# EAGLE design atx4vc (EAGLE 9.6.2)
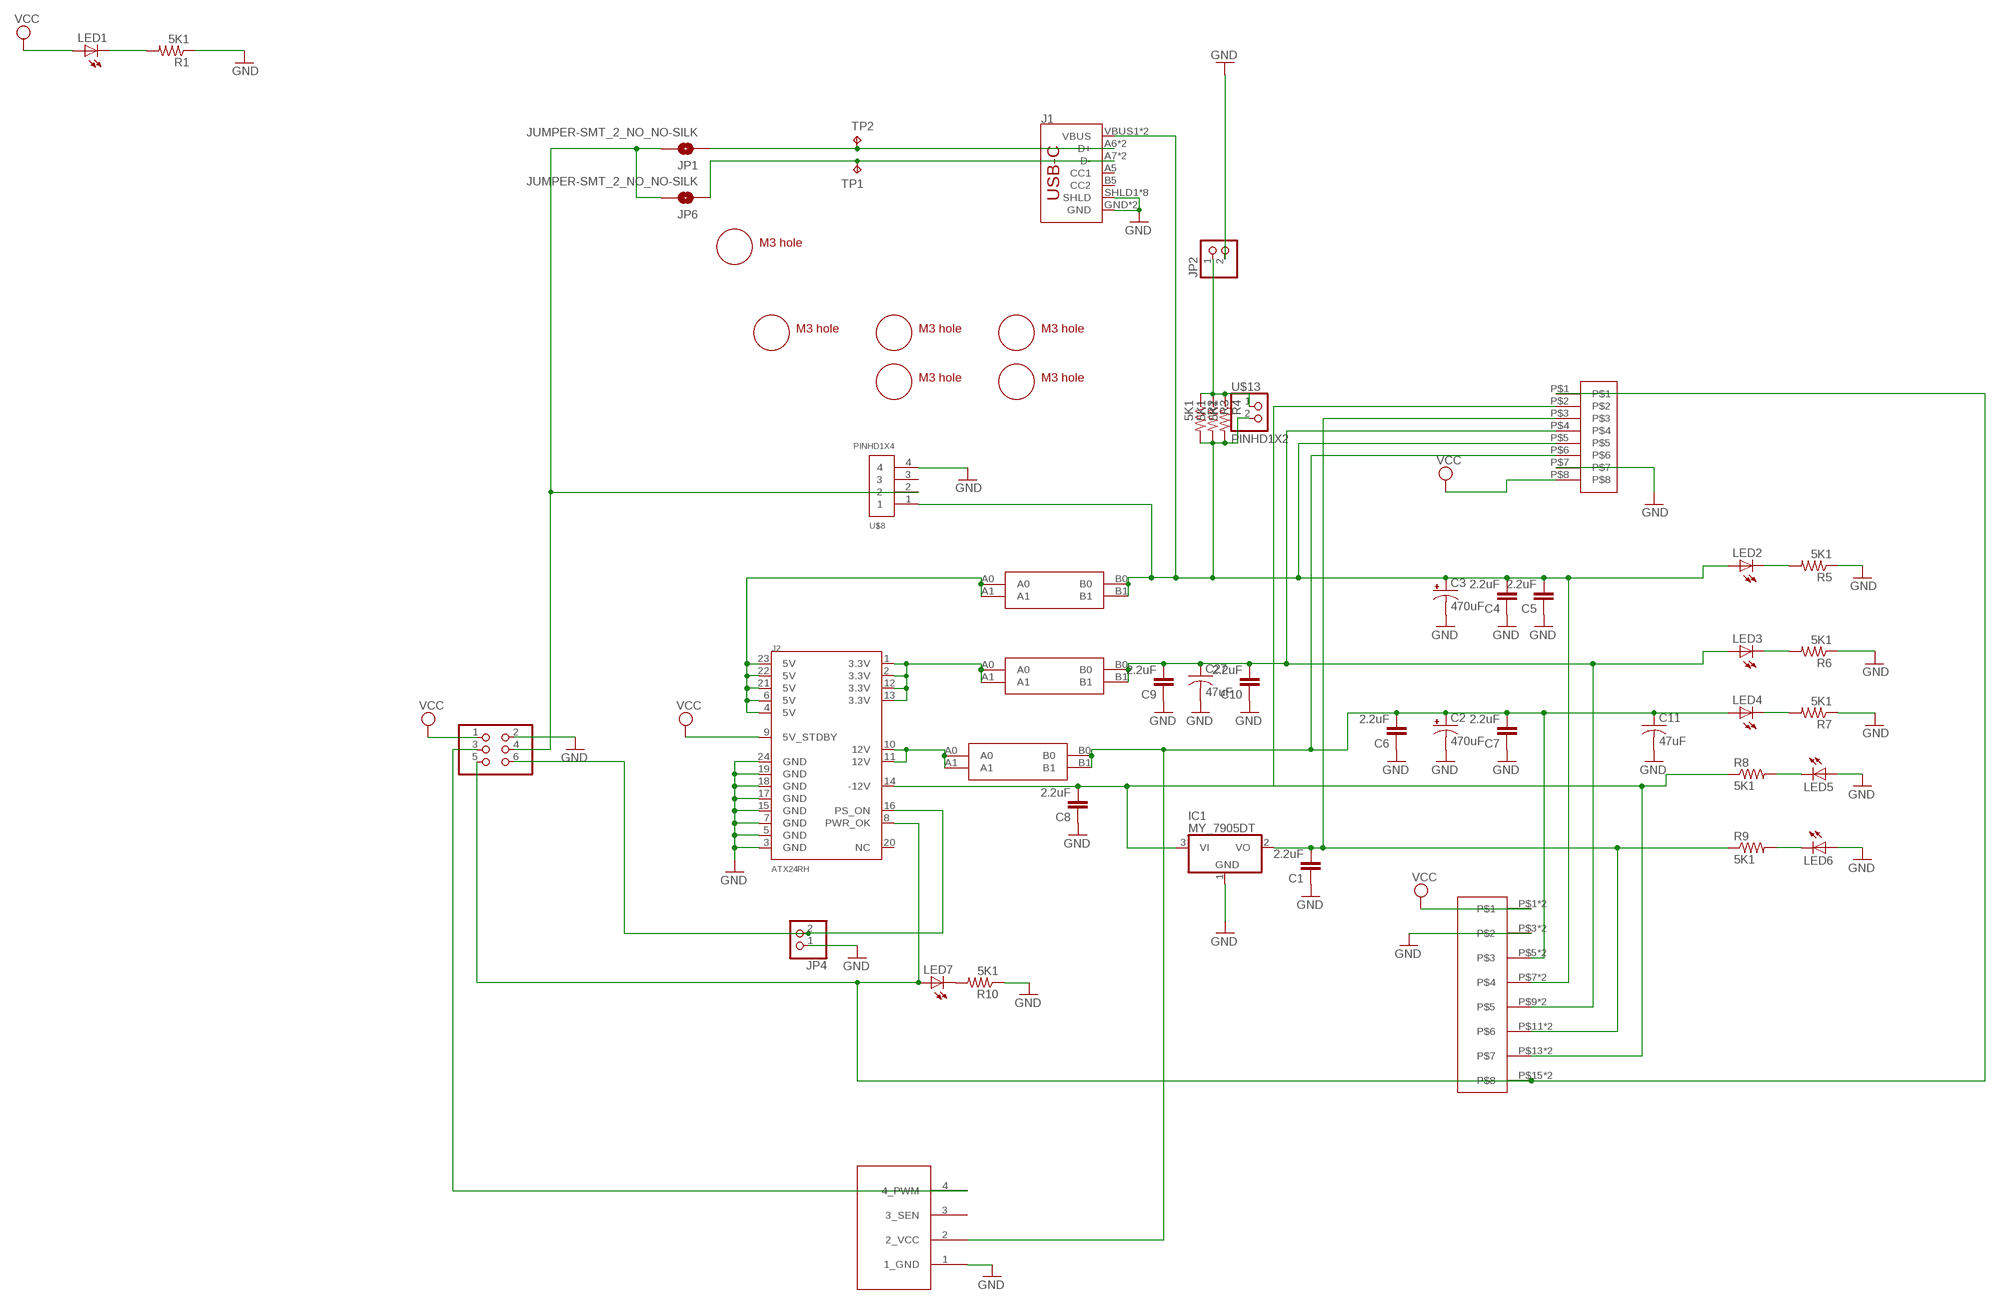
[diagram p0: schematic, sheet 1]

## Parts
C1  2.2uF  CAP0805  [0805$1]
C2  470uF  CPOL-USSMCD  [SMC_D]
C3  470uF  CPOL-USSMCD  [SMC_D]
C4  2.2uF  CAP0805  [0805$1]
C5  2.2uF  CAP0805  [0805$1]
C6  2.2uF  CAP0805  [0805$1]
C7  2.2uF  CAP0805  [0805$1]
C8  2.2uF  CAP0805  [0805$1]
C9  2.2uF  CAP0805  [0805$1]
C10  2.2uF  CAP0805  [0805$1]
C11  47uF  C-USC1210  [C1210]
C27  47uF  C-USC1210  [C1210]
IC1  MY_7905DT  [ADAFRUIT_TO252]
J1  USB_C16PIN  [USB-C-16P]
J2  ATX24RH  [ATX24_RIGHT_ANGLE]
JP1  JUMPER-SMT_2_NO_NO-SILK  [SMT-JUMPER_2_NO_NO-SILK]
JP2  PINHD-1X2  [1X02]
JP3  PINHD-2X3  [2X03]
JP4  PINHD-1X2  [1X02]
JP5  4PIN_FAN  [1X04]
JP6  JUMPER-SMT_2_NO_NO-SILK  [SMT-JUMPER_2_NO_NO-SILK]
LED1  LEDCHIP-LED0805  [CHIP-LED0805]
LED2  LEDCHIP-LED0805  [CHIP-LED0805]
LED3  LEDCHIP-LED0805  [CHIP-LED0805]
LED4  LEDCHIP-LED0805  [CHIP-LED0805]
LED5  LEDCHIP-LED0805  [CHIP-LED0805]
LED6  LEDCHIP-LED0805  [CHIP-LED0805]
LED7  LEDCHIP-LED0805  [CHIP-LED0805]
R1  5K1  RESISTOR0805-RES  [0805]
R2  5K1  RESISTOR0805-RES  [0805]
R3  5K1  RESISTOR0805-RES  [0805]
R4  5K1  RESISTOR0805-RES  [0805]
R5  5K1  RESISTOR0805-RES  [0805]
R6  5K1  RESISTOR0805-RES  [0805]
R7  5K1  RESISTOR0805-RES  [0805]
R8  5K1  RESISTOR0805-RES  [0805]
R9  5K1  RESISTOR0805-RES  [0805]
R10  5K1  RESISTOR0805-RES  [0805]
TP1  TPTP12R  [TP12R]
TP2  TPTP12R  [TP12R]
U$1  M3_MOUNTING_HOLE  [M3_MOUNTING_HOLE_PACK]
U$2  M3_MOUNTING_HOLE  [M3_MOUNTING_HOLE_PACK]
U$3  M3_MOUNTING_HOLE  [M3_MOUNTING_HOLE_PACK]
U$4  M3_MOUNTING_HOLE  [M3_MOUNTING_HOLE_PACK]
U$5  M3_MOUNTING_HOLE  [M3_MOUNTING_HOLE_PACK]
U$6  M3_MOUNTING_HOLE  [M3_MOUNTING_HOLE_PACK]
U$7  396_CONN_VH396_8P  [396_CONN_396_8P]
U$8  PINHD1X4  [1X04-CLEANBIG]
U$9  CAR_FUSE_HOLDER3IN1  [FUSE_HOLDER_3IN1]
U$10  CAR_FUSE_HOLDER3IN1  [FUSE_HOLDER_3IN1]
U$11  CAR_FUSE_HOLDER3IN1  [FUSE_HOLDER_3IN1]
U$12  DG2204R-5.0-8DG2204-8  [DG2204R-8]
U$13  PINHD1X2  [1X02]

## Nets
-5V: C1.2 IC1.2(VO) R9.1 U$7.P$3 U$12.P$11 U$12.P$12
-12V: C8.2 IC1.3(VI) J2.14(-12V) R8.1 U$7.P$2 U$12.P$13 U$12.P$14
F3V3: C9.2 C10.2 C27.1 LED3.A U$7.P$4 U$10.B0 U$10.B1 U$12.P$9 U$12.P$10
F5V: C3.+ C4.2 C5.2 J1.VBUS1(VBUS) J1.VBUS2(VBUS) LED2.A R2.2 R3.2 R4.2 U$7.P$5 U$8.1 U$9.B0 U$9.B1 U$12.P$7 U$12.P$8 U$13.2
F12V: C2.+ C6.2 C7.2 C11.1 JP5.2(2_VCC) LED4.A U$7.P$6 U$11.B0 U$11.B1 U$12.P$5 U$12.P$6
GND: C1.1 C2.- C3.- C4.1 C5.1 C6.1 C7.1 C8.1 C9.1 C10.1 C11.2 C27.2 IC1.1(GND) J1.GND J1.GND2(GND) J1.SHLD1(SHLD) J1.SHLD2(SHLD) J1.SHLD3(SHLD) J1.SHLD4(SHLD) J1.SHLD5(SHLD) J1.SHLD6(SHLD) J1.SHLD7(SHLD) J1.SHLD8(SHLD) J2.3(GND) J2.5(GND) J2.7(GND) J2.15(GND) J2.17(GND) J2.18(GND) J2.19(GND) J2.24(GND) JP2.2 JP3.2 JP4.1 JP5.1(1_GND) LED5.A LED6.A R1.1 R5.1 R6.1 R7.1 R10.1 U$7.P$7 U$8.4 U$12.P$3 U$12.P$4
N$1: LED7.C R10.2
N$2: J1.A6(D+) J1.B6(D+) JP1.1 TP2.TP
N$3: JP3.3 JP5.4(4_PWM)
N$4: J1.A7(D-) J1.B7(D-) JP6.1 TP1.TP
N$5: LED6.C R9.2
N$7: JP1.2 JP3.4 JP6.2 U$8.2
N$8: LED5.C R8.2
N$9: LED4.C R7.2
N$10: J2.4(5V) J2.6(5V) J2.21(5V) J2.22(5V) J2.23(5V) U$9.A0 U$9.A1
N$11: J2.8(PWR_OK) JP3.5 LED7.A U$7.P$1 U$12.P$15 U$12.P$16
N$14: J2.1(3.3V) J2.2(3.3V) J2.12(3.3V) J2.13(3.3V) U$10.A0 U$10.A1
N$15: J2.16(PS_ON) JP3.6 JP4.2
N$17: JP2.1 R2.1 R3.1 R4.1 U$13.1
N$18: LED3.C R6.2
N$20: LED2.C R5.2
N$21: J2.10(12V) J2.11(12V) U$11.A0 U$11.A1
N$29: LED1.C R1.2
VCC: J2.9(5V_STDBY) JP3.1 LED1.A U$7.P$8 U$12.P$1 U$12.P$2
Unconnected: J1.A5(CC1) J1.B5(CC2) J2.20(NC) JP5.3(3_SEN) U$8.3

## Library data of the parts
C1 C4-C10 = atx_power_control:CAP: Capacitor Standard 0603 ceramic capacitor, and 0.1" leaded capacitor.
C2 C3 = rcl:CPOL-US: POLARIZED CAPACITOR, American symbol; SPICEPREFIX: C
C11 C27 = clock:C-US: CAPACITOR, American symbol
IC1 = atx_power_control:MY_7905: Positive VOLTAGE REGULATOR Added bigger pads to the TO-92 package
J1 = SparkFun-Connectors:USB_C: USB Type C 16Pin Connector Super Speed pins not available on the 16-pin purely SMD connector so this part is best for USB 2.0 implementations. D1 and D2 are tied together enabling D+/- no matter which way the cable is plugged into the connector. The two channel configuration pins (CC1/2) are exposed. These are normally connected to ground via 5.1k resistors but can be reconfigured for high current/high power applications.; PROD_ID: CONN-14122
J2 = nomcu:ATX24: ATX24 Pin Power Supply Connector This is a good connector for connecting a computer power supply to a PCB. It's massive, but provides many amps of power at 5V and 12V. SKU: PRT-09498
JP1 JP6 = SparkFun-Jumpers:JUMPER-SMT_2_NO: Normally open jumper This jumper has two pads in close proximity to each other. Apply solder to close the connection. Round pads are easier to solder for beginners, but are a lot larger. SparkFun Product that uses the round pads: SparkFun EL Sequencer <https://www.sparkfun.com/products/12781>
JP2 JP4 = pinhead:PINHD-1X2: PIN HEADER
JP3 = pinhead:PINHD-2X3: PIN HEADER
JP5 = appleii:4PIN_FAN: PIN HEADER
LED1-LED7 = adafruit:LED: LED OSRAM: - CHIPLED LG R971, LG N971, LY N971, LG Q971, LY Q971, LO R971, LY R971 LH N974, LH R974 LS Q976, LO Q976, LY Q976 LO Q996 - Hyper CHIPLED LW Q18S LB Q993, LB Q99A, LB R99A - SideLED LS A670, LO A670, LY A670, LG A670, LP A670 LB A673, LV A673, LT A673, LW A673 LH A674 LY A675 LS A676, LA A676, LO A676, LY A676, LW A676 LS A679, LY A679, LG A679 - Hyper Micro SIDELED® LS Y876, LA Y876, LO Y876, LY Y876 LT Y87S - SmartLED LW L88C, LW L88S LB L89C, LB L89S, LG L890 LS L89K, LO L89K, LY L89K LS L896, LA L896, LO L896, LY L896 - TOPLED LS T670, LO T670, LY T670, LG T670, LP T670 LSG T670, LSP T670, LSY T670, LOP T670, LYG T670 LG T671, LOG T671, LSG T671 LB T673, LV T673, LT T673, LW T673 LH T674 LS T676, LA T676, LO T676, LY T676, LB T676, LH T676, LSB T676, LW T676 LB T67C, LV T67C, LT T67C, LS T67K, LO T67K, LY T67K, LW E67C LS E67B, LA E67B, LO E67B, LY E67B, LB E67C, LV E67C, LT E67C LW T67C LS T679, LY T679, LG T679 LS T770, LO T770, LY T770, LG T770, LP T770 LB T773, LV T773, LT T773, LW T773 LH T774 LS E675, LA E675, LY E675, LS T675 LS T776, LA T776, LO T776, LY T776, LB T776 LHGB T686 LT T68C, LB T68C - Hyper Mini TOPLED® LB M676 - Mini TOPLED Santana® LG M470 LS M47K, LO M47K, LY M47K Source: http://www.osram.convergy.de/
R1-R7 R10 = atx_power_control:RESISTOR: Resistor Basic schematic elements and footprints for 0603, 1206, and PTH resistors.
R8 R9 = SparkFun-Passives:RESISTOR: Resistor Basic schematic elements and footprints for 0603, 1206, and PTH resistors.
TP1 TP2 = testpad:TP: Test pad
U$1-U$6 = a:M3_MOUNTING_HOLE
U$7 = atx4vc:396_CONN_VH396_8P
U$8 = adafruit_changed:PINHD1X4
U$9-U$11 = atx_power_control:CAR_FUSE_HOLDER
U$12 = atx4vc:DG2204R-5.0-8
U$13 = adafruit_changed:PINHD1X2

## Board
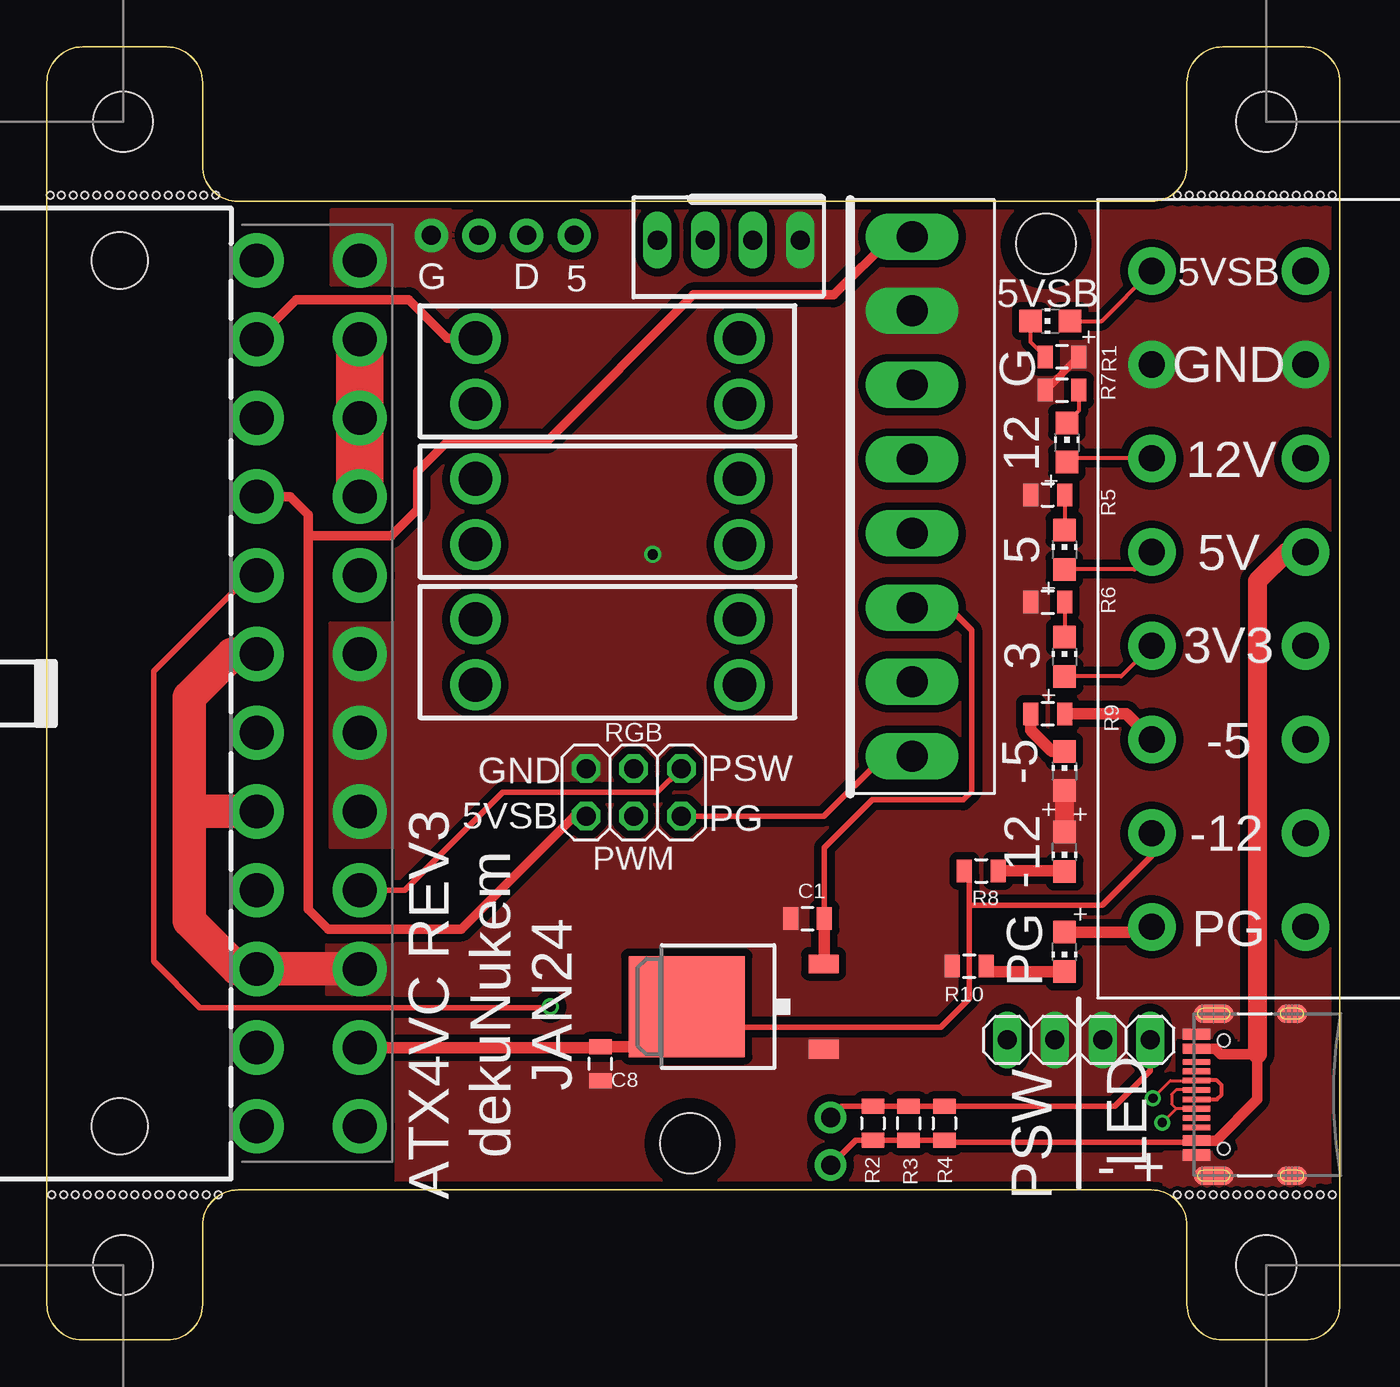
[diagram p1: board, top side]
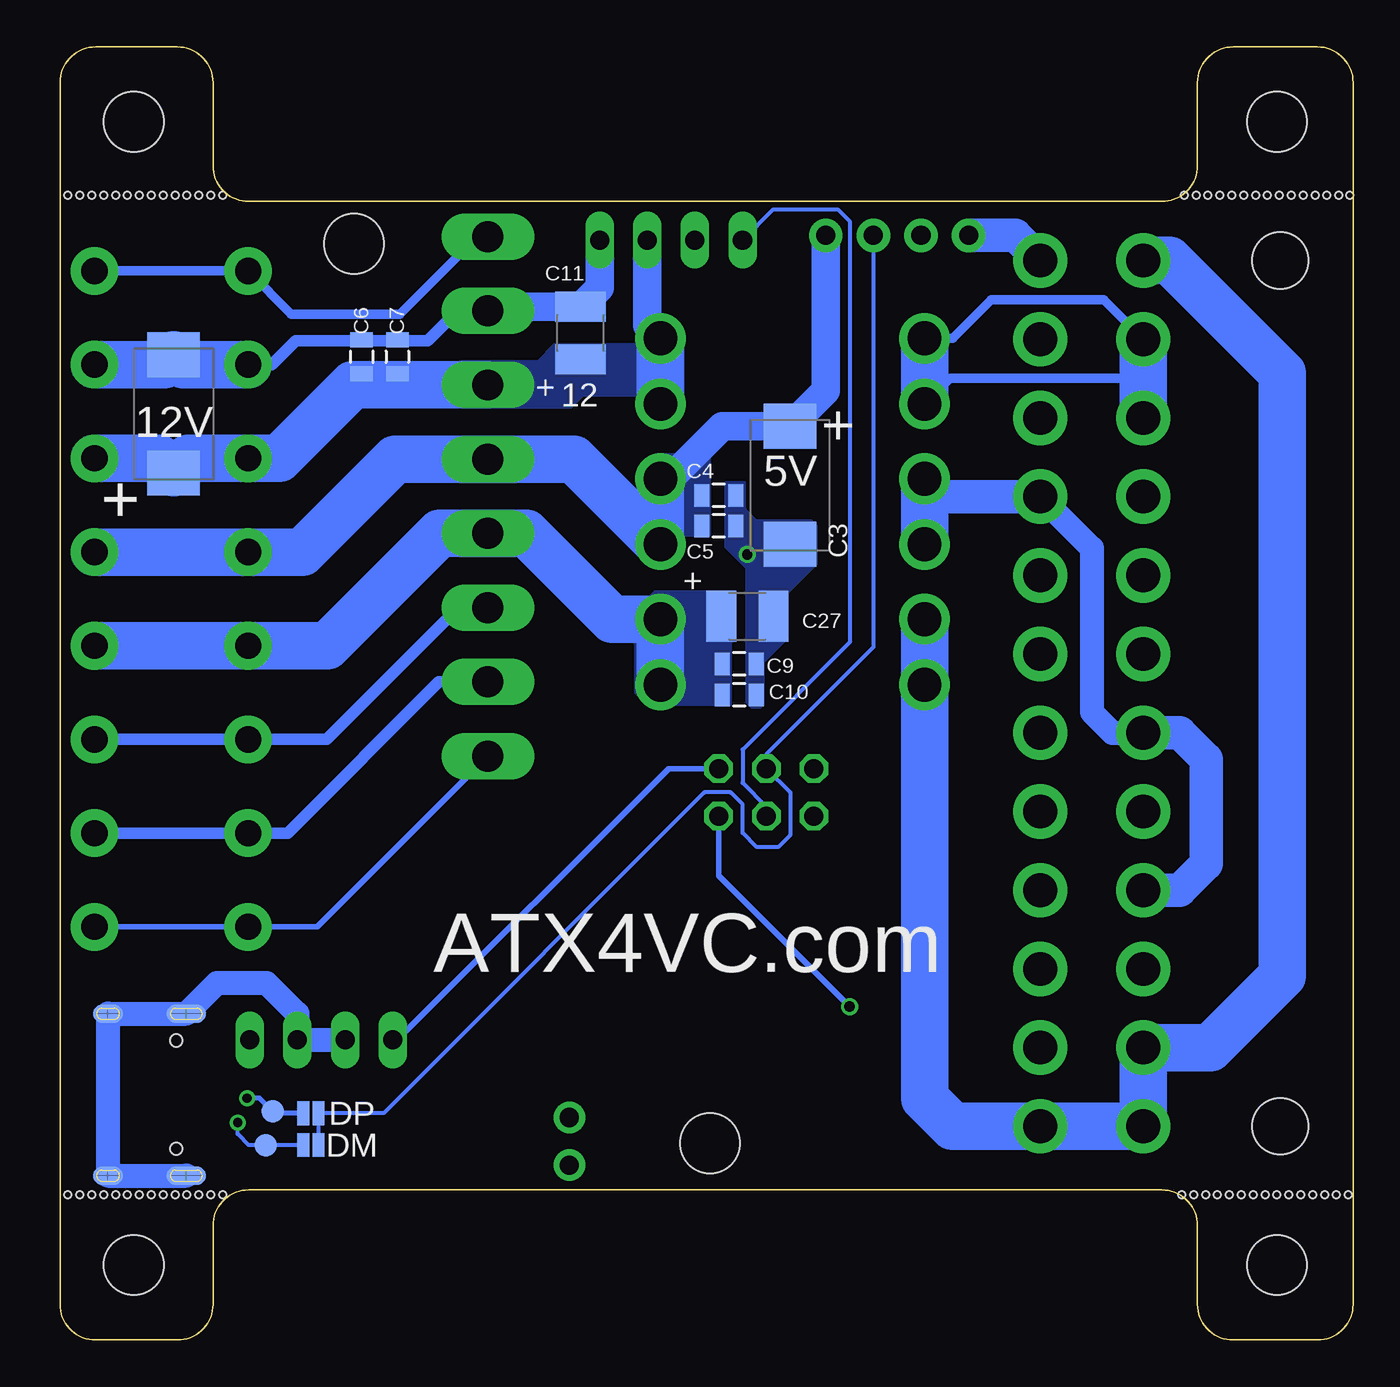
[diagram p2: board, bottom side, seen from below]

Size 69 x 69 mm. Coordinates in mm from the lower left corner, seen from the top.
Outline: 10.21,60.75 58.93,60.75 arc90 60.83,62.66 60.83,67.09 arc-90 62.74,69 67.09,69 arc-90 69,67.09 69,1.91 arc-90 67.09,0 62.74,0 arc-90 60.83,1.91 60.83,6.1 arc90 58.93,8.01 10.21,8.01 arc90 8.31,6.1 8.31,1.91 arc-90 6.4,0 1.91,0 arc-90 0,1.91 0,67.09 arc-90 1.91,69 6.4,69 arc-90 8.31,67.09 8.31,62.66 arc90 10.21,60.75
Copper layers (1*16): Top 0.035mm / dielectric 1.5mm / Bottom 0.035mm
Design rules "deku_2layer_6mil": minimum track width 6mil, minimum drill 15mil, track to track 6mil, track to pad 6mil, pad to pad 6mil, via to via 6mil, smd to smd 6mil, copper to edge 10mil, drill to drill 6mil, minimum pad ring 7mil, minimum via ring 7mil, stop-mask expansion 4mil, vias tented up to drill 25mil, thermal gap 10mil
Holes 0.38 mm at 0.18,61.09 0.76,61.09 1.4,61.09 2.03,61.09 2.67,61.09 3.3,61.09 3.94,61.09 4.57,61.09 5.21,61.09 5.84,61.09 6.48,61.09 7.11,61.09 7.75,61.09 8.38,61.09 0.25,7.75 0.89,7.75 1.52,7.75 2.16,7.75 2.79,7.75 3.43,7.75 4.06,7.75 4.7,7.75 5.33,7.75 5.97,7.75 6.6,7.75 7.24,7.75 7.87,7.75 8.51,7.75 60.33,7.75 60.96,7.75 61.59,7.75 62.23,7.75 62.87,7.75 63.5,7.75 64.14,7.75 64.77,7.75 65.41,7.75 66.04,7.75 66.67,7.75 67.31,7.75 67.94,7.75 68.58,7.75 60.96,61.09 61.59,61.09 62.23,61.09 62.87,61.09 63.5,61.09 64.14,61.09 64.77,61.09 65.41,61.09 66.04,61.09 66.67,61.09 67.31,61.09 67.94,61.09 68.58,61.09 9.14,7.75 9.02,61.09 60.33,61.09
tRestrict: area 0,0 to 8,8; area 0,60.9 to 8,68.9; area 61.1,61.1 to 69.1,69.1; area 61.1,0 to 69.1,8
bRestrict: area 0,0 to 8,8; area 61.1,0 to 69.1,8; area 0,60.9 to 8,68.9; area 61.1,61.1 to 69.1,69.1

### Footprints (pad centres in the part's own frame; a part is rotated, then mirrored left to right if it is on the bottom)
0805$1 = smd 0.8 x 1.2: 1 -0.9,0; 2 0.9,0
SMC_D = smd 2.4 x 2.8: + -3.15,0; - 3.15,0
C1210 = smd 1.6 x 2.7: 1 -1.4,0; 2 1.4,0
ADAFRUIT_TO252 = smd 1 x 1.6: 1 -2.28,-4.8; 2 2.28,-4.8 | smd 5.4 x 6.2: 3 0,2.5
USB-C-16P = smd 0.3 x 1.45: A5 -1.25,0; A6 -0.25,0; A7 0.25,0; A8 1.25,0; B5 1.75,0; B6 0.75,0; B7 -0.75,0; B8 -1.75,0 | smd 0.6 x 1.45: GND -3.225,0; GND2 3.225,0 | smd 1 x 2.1: SHLD1 -4.32,-0.915; SHLD2 4.32,-0.915 | smd 1 x 2.1 bottom: SHLD3 -4.32,-0.915; SHLD4 4.32,-0.915 | smd 1 x 1.6: SHLD5 -4.32,-5.095; SHLD8 4.32,-5.095 | smd 1 x 1.6 bottom: SHLD6 -4.32,-5.095; SHLD7 4.32,-5.095 | smd 0.55 x 1.45: VBUS1 -2.45,0; VBUS2 2.45,0 | hole 0.65: -2.89,-1.445; 2.89,-1.445
ATX24_RIGHT_ANGLE = drill 1.8 pad 2.9: 1 23.1,4.76; 2 18.9,4.76; 3 14.7,4.76; 4 10.5,4.76; 5 6.3,4.76; 6 2.1,4.76; 7 -2.1,4.76; 8 -6.3,4.76; 9 -10.5,4.76; 10 -14.7,4.76; 11 -18.9,4.76; 12 -23.1,4.76; 13 23.1,10.26; 14 18.9,10.26; 15 14.7,10.26; 16 10.5,10.26; 17 6.3,10.26; 18 2.1,10.26; 19 -2.1,10.26; 20 -6.3,10.26; 21 -10.5,10.26; 22 -14.7,10.26; 23 -18.9,10.26; 24 -23.1,10.26 | hole 3: -23.1,-2.54; 23.1,-2.54
SMT-JUMPER_2_NO_NO-SILK = smd 0.635 x 1.27: 1 -0.406,0; 2 0.406,0
1X02 = drill 1.016 long: 1 -1.27,0; 2 1.27,0
2X03 = drill 1.016 octagon: 1 -2.54,-1.27; 2 -2.54,1.27; 3 0,-1.27; 4 0,1.27; 5 2.54,-1.27; 6 2.54,1.27
1X04 = drill 1.016 long: 1 -3.81,0; 2 -1.27,0; 3 1.27,0; 4 3.81,0
CHIP-LED0805 = smd 1.2 x 1.2: A 0,-1.05; C 0,1.05
0805 = smd 0.8 x 1.2: 1 -0.9,0; 2 0.9,0
TP12R = smd 1.2 x 1.2: TP 0,0
M3_MOUNTING_HOLE_PACK = hole 3.2: 0,0
396_CONN_396_8P = drill 1.65 long: P$1 -11.88,0; P$2 -7.92,0; P$3 -3.96,0; P$4 0,0; P$5 3.96,0; P$6 7.92,0; P$7 11.88,0; P$8 15.84,0
1X04-CLEANBIG = drill 1.016 pad 1.778: 1 -3.81,0; 2 -1.27,0; 3 1.27,0; 4 3.81,0
FUSE_HOLDER_3IN1 = drill 1.8: A0 -7.05,1.75; A1 -7.05,-1.75; B0 7.05,1.75; B1 7.05,-1.75
DG2204R-8 = drill 1.4 pad 2.54: P$1 -15,4.1; P$2 -15,-4.1; P$3 -10,4.1; P$4 -10,-4.1; P$5 -5,4.1; P$6 -5,-4.1; P$7 0,4.1; P$8 0,-4.1; P$9 5,4.1; P$10 5,-4.1; P$11 10,4.1; P$12 10,-4.1; P$13 15,4.1; P$14 15,-4.1; P$15 20,4.1; P$16 20,-4.1
1X02' = drill 1.016 pad 1.676: 1 -1.27,0; 2 1.27,0

### Placement (x,y rotation side)
C1  40.58,22.48 0 top
C2  62.94,49.41 90 bottom
C3  30.04,45.6 270 bottom
C4  33.85,45.07 180 bottom
C5  33.85,43.44 180 bottom
C6  52.9,52.46 270 bottom
C7  51,52.46 270 bottom
C8  29.54,14.74 90 top
C9  32.76,36.08 180 bottom
C10  32.76,34.42 180 bottom
C11  41.22,53.73 90 bottom
C27  32.33,38.62 0 bottom
IC1  36.65,17.79 90 top
J1  61.35,13.09 90 top
J2  6.44,34.5 270 top
JP1  55.62,12.1 0 bottom
JP2  57.6,16.01 180 top
JP3  31.31,29.22 0 top
JP4  52.52,16.01 180 top
JP5  36.39,58.68 180 top
JP6  55.62,10.4 0 bottom
LED1  53.54,54.36 90 top
LED2  54.3,42.17 0 top
LED3  54.3,36.46 0 top
LED4  54.43,47.89 0 top
LED5  54.3,26.04 180 top
LED6  54.3,30.36 0 top
LED7  54.3,20.71 180 top
R1  54.17,52.46 180 top
R2  44.08,11.56 270 top
R3  45.98,11.56 270 top
R4  47.89,11.56 270 top
R5  53.41,45.09 0 top
R6  53.41,39.38 0 top
R7  54.17,50.68 0 top
R8  49.86,25.03 0 top
R9  53.41,33.41 180 top
R10  49.22,19.95 0 top
TP1  58.02,10.4 0 bottom
TP2  57.66,12.19 0 bottom
U$1  34.32,10.5 0 top
U$2  53.32,58.5 0 top
U$3  4.07,65 0 top
U$4  4.07,4 0 top
U$5  65.07,65 0 top
U$6  65.07,4 0 top
U$7  46.17,43.04 90 top
U$8  24.33,58.94 180 top
U$9  29.92,44.2 0 top
U$10  29.92,36.71 0 top
U$11  29.92,51.7 0 top
U$12  63.06,42.05 270 top
U$13  PINHD1X2  [1X02']  41.82,10.6 270 top

### Tracks (layer width: path | path; a pad name or v marks a point on that pad's centre or on a via)
-5V
  Top 0.305: U$7.P$3 48.14,39.08 49.34,37.87 49.34,29.27 48.9,28.82 44.04,28.82 41.48,26.27 C1.2
  Top 0.61: R9.1 57.6,33.41 U$12.P$12 | C1.2 41.48,20.11 IC1.2
  Bottom 0.61: U$12.P$11 U$12.P$12 54.78,32.05 47.74,39.08 U$7.P$3
-12V
  Top 0.305: IC1.3 35.25,16.69 47.71,16.69 49.22,18.2 49.22,23.2 | 49.22,23.2 49.22,24.77 R8.1 | U$12.P$14 58.96,25.85 56.32,23.2 49.22,23.2
  Top 0.61: J2.14 29.5,15.6 C8.2 32,15.64 IC1.3
  Bottom 0.61: U$12.P$13 U$12.P$14 56.85,27.05 48.78,35.12 U$7.P$2
F3V3
  Top 0.203: U$12.P$10 57.33,35.41 LED3.A
  Bottom 2.54: U$10.B1 U$10.B0 39.54,38.46 44.12,43.04 U$7.P$4 48.74,43.04 54.73,37.05 U$12.P$10 U$12.P$9
  pour Bottom (no thermals): 33.22,39.89 37.28,39.89 38.3,38.87 38.3,34.55 37.66,33.92 33.22,33.92
F5V
  Top 0.203: U$12.P$8 58.04,41.12 LED2.A
  Top 0.305: J1.VBUS1 61.25,10.54 48.01,10.54 R4.2 R3.2 R2.2 43.15,10.66 U$13.2
  Top 0.559: J1.VBUS1 62.39,10.64 64.59,12.84 64.59,15.25 62.63,15.25 62.34,15.54 J1.VBUS2
  Top 1.016: U$12.P$7 66.15,42.05 64.59,40.48 64.59,15.25
  Bottom 1.524: U$8.1 28.14,50.66 C3.+ 33.66,48.75 36.46,45.95 U$9.B0
  Bottom 2.54: U$9.B0 U$9.B1 37.06,42.45 41.6,47 U$7.P$5 51.13,47 56.08,42.05 U$12.P$8 U$12.P$7
  pour Bottom (no thermals): 34.36,47.25 34.36,42.93 37.16,42.93 37.16,47.25
F12V
  Top 0.203: U$12.P$6 54.63,47.05 LED4.A
  Bottom 0.203: C6.2 C7.2 50.4,50.96 U$7.P$6
  Bottom 1.524: JP5.2 37.66,54.14 U$11.B0
  Bottom 2.54: U$11.B0 U$11.B1 | U$7.P$6 53.39,50.96 57.3,47.05 U$12.P$6 62.15,47.05 C2.+ 63.72,47.05 U$12.P$5
  pour Bottom (no thermals): 42.62,53.09 43.51,52.2 47.57,52.2 47.57,49.79 41.73,49.79 41.09,50.43 35.76,50.43 35.76,53.09
GND  (via drill 0.55)
  Top 0.406: R1.1 53.29,50.68 R7.1
  Top 1.016: LED6.A LED5.A
  Top 1.778: J2.7 9.9,36.6 7.6,34.3 7.6,28.2 | J2.15 J2.3 10.16,19.8 7.6,22.36 7.6,28.2 | J2.5 7.6,28.2
  Bottom 0.203: C6.1 C7.1 49.41,53.36 49.37,53.32
  Bottom 0.61: U$12.P$4 57.69,52.05 56.42,53.32 49.37,53.32 47.78,54.92 U$7.P$7
  Bottom 1.27: J1.SHLD3 J1.SHLD5 J1.SHLD8 J1.SHLD4 60.61,19.06 57.98,19.06 56.33,17.41 JP2.2 JP4.1
  Bottom 1.524: JP5.1 40.2,56.15 C11.2 45.96,55.13 U$7.P$7
  Bottom 1.778: J2.24 18.03,58.94 U$8.4
  Bottom 2.54: U$12.P$4 62.42,52.05 C2.- 63.45,52.05 U$12.P$3
  other vias: 32.33,41.92
  pour Top (isolate 0.406): 18.61,8.01 69.31,8.01 69.31,60.74 18.61,60.74
  pour Top: 15.09,38.23 15.09,26.3 19.12,26.3 19.12,38.23
  pour Top (no thermals): 60.4,18.17 63.57,18.17 63.57,16.14 60.4,16.14
  pour Top (no thermals): 65.6,15.5 65.6,18.68 67.64,18.68 67.64,15.5
  pour Top (no thermals): 67.64,8.01 59.63,8.01 59.63,10.04 67.64,10.04
  pour Top (no thermals): 21.53,56.27 15.18,56.27 15.18,60.33 21.53,60.33
  pour Top (no thermals): 52.65,14.11 52.65,18.3 57.48,18.3 57.48,14.11
  pour Top (no thermals): 23.31,18.42 14.93,18.42 14.93,21.09 23.31,21.09
  pour Top (no thermals): 55.57,30.36 55.57,26.17 53.03,26.17 53.03,30.36
  pour Top (no thermals): 29.79,29.85 27.63,29.85 27.63,31.63 29.79,31.63
  pour Bottom (no thermals): 33.47,45.73 33.47,42.3 32.35,41.17 32.35,34.02 32.12,33.79 31.61,33.79 31.49,33.92 31.49,36.16 30.17,37.47 30.17,39.89 28.65,41.41 28.65,43.44 28.9,43.7 31.82,43.7 32.46,44.33 32.46,45.73
N$1
  Top 0.61: R10.2 50.41,19.66 LED7.C
N$2  (via drill 0.5)
  Top 0.152: J1.B6 59.96,13.84 v59.02,12.9
  Top 0.203: J1.A6 62.43,12.84 62.68,13.09 62.68,13.6 62.43,13.85 61.36,13.85 J1.B6
  Bottom 0.254: JP1.1 57.57,12.1 TP2.TP 58.37,12.9 v59.02,12.9
N$3
  Bottom 0.203: JP5.4 30.93,60.33 27.5,60.33 26.87,59.7 26.87,37.22 32.58,31.5 32.58,29.73 31.31,28.46 JP3.3
N$4  (via drill 0.5)
  Top 0.152: J1.A7 60.26,13.34 60.02,13.1 60.02,12.58 60.26,12.34 | J1.B7 60.26,12.34 | 60.26,12.34 v59.52,11.6
  Bottom 0.203: JP6.1 TP1.TP 58.92,10.4 59.52,11 v59.52,11.6
N$5
  Top 0.61: R9.2 52.51,32.53 53.63,31.41 LED6.C
N$7
  Bottom 0.203: U$8.2 25.6,36.97 31.31,31.25 JP3.4 30.04,29.22 30.04,26.93 30.68,26.3 31.82,26.3 32.58,27.06 32.58,28.58 33.22,29.22 34.62,29.22 51.73,12.1 JP1.2 JP6.2
N$8
  Top 0.61: R8.2 54.27,25.03 LED5.C
N$9
  Top 0.203: R7.2 55.07,49.59 LED4.C
N$10
  Top 2.54: J2.23 J2.22 J2.21
  Bottom 1.27: J2.21 13.95,42.25 13.95,33.5 12.85,32.4 J2.6
  Bottom 1.778: J2.21 21.91,45 U$9.A0 | J2.6 9.26,32.4 7.85,31 7.85,25.41 9.26,24 J2.4
  Bottom 2.54: U$9.A0 U$9.A1
N$11  (via drill 0.55)
  Top 0.305: J2.8 10.82,40.8 5.69,35.68 5.69,20.2 8.15,17.74 26.82,17.74 v26.87,17.79 | JP3.5 41.46,27.95 44.67,31.16 U$7.P$1
  Top 0.61: LED7.A 58.68,21.76 U$12.P$16
  Bottom 0.305: v26.87,17.79 33.85,24.77 JP3.5 | U$7.P$1 55.28,22.05 U$12.P$16 U$12.P$15
N$14
  Bottom 2.54: J2.12 9.8,57.6 3.79,51.59 3.79,19.44 7.62,15.6 J2.2 J2.1 J2.13 21.37,11.4 22.87,12.9 U$10.A1 U$10.A0
N$15
  Top 0.305: J2.16 19.11,24 24.33,29.22 32.58,29.22 JP3.6
  Bottom 0.305: JP4.2 51,16.01 36.52,30.49 JP3.6
N$17
  Top 0.305: JP2.1 58.87,14.36 56.98,12.46 R4.1 R3.1 R2.1 42.41,12.46 U$13.1
N$18
  Top 0.203: LED3.C 54.31,37.52 R6.2
N$20
  Top 0.203: R5.2 54.31,43.23 LED2.C
N$21
  Top 0.508: J2.11 13.3,55.51 19.31,55.51 21.38,53.45 U$11.A0
  Bottom 0.508: J2.11 13.3,55.51 19.31,55.51 21.38,53.45 U$11.A0 | U$11.A1 21.5,51.32 11.2,51.32
  Bottom 2.54: J2.11 11.2,51.32 J2.10 | U$11.A0 U$11.A1
N$29
  Top 0.203: R1.2 52.49,53.24 LED1.C
VCC
  Top 0.203: LED1.A 56.28,54.36 U$12.P$2
  Top 0.508: J2.9 12.97,45 13.95,44.03 13.95,42.91 | 13.95,42.91 13.95,23 15.01,21.93 22.12,21.93 28.14,27.95 JP3.1 | 13.95,42.91 18.37,42.91 19.79,44.33 19.79,46.36 21.39,47.96 26.69,47.96 34.49,55.76 41.98,55.76 45.1,58.88 U$7.P$8
  Bottom 0.508: U$12.P$1 U$12.P$2 56.66,54.74 50.87,54.74 46.74,58.88 U$7.P$8

### Text on the board
tNames: MAKE SURE TO USE / 12V RATED CAPS ON 12V LINES | G | D | 5 | 5VSB | 5VSB | G | GND | 12 | 12V | 5 | 5V | 3 | 3V3 | RGB | -5 | PSW | -5 | GND | 5VSB | PG | -12 | PWM | -12 | PG | PG | ATX4VC REV3 / dekuNukem / JAN24 | LED | PSW | - +
bNames: 12 | 12V | + | 5V | + | ATX4VC.com | DP | DM